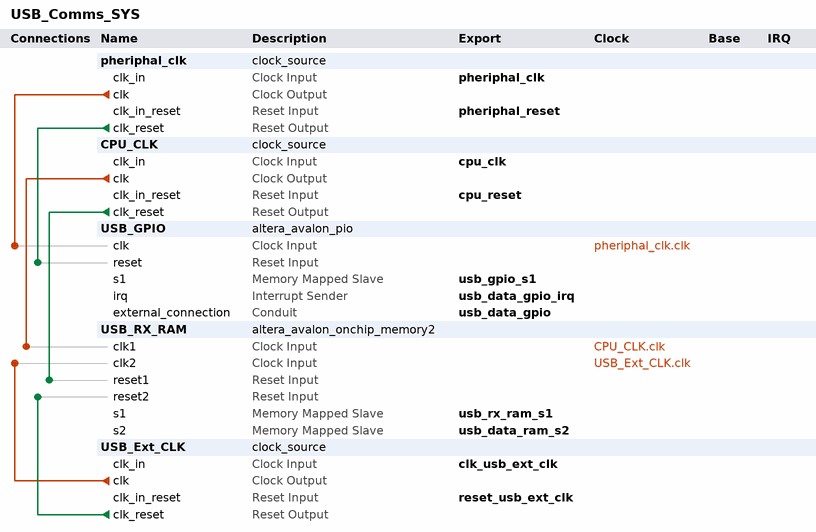
[diagram p0: system contents]
# Platform Designer (Qsys) system USB_Comms_SYS, MAX 10 10M50DAF484I7G
# Parameters at their usual value, and those the tool derives, are not listed.
package require -exact qsys 18.1
create_system USB_Comms_SYS
set_project_property DEVICE_FAMILY {MAX 10}
set_project_property DEVICE 10M50DAF484I7G

add_instance pheriphal_clk clock_source 18.1
set_instance_parameter_value pheriphal_clk clockFrequency 50000000

add_instance CPU_CLK clock_source 18.1
set_instance_parameter_value CPU_CLK clockFrequency 50000000

add_instance USB_GPIO altera_avalon_pio 18.1
set_instance_parameter_value USB_GPIO bitModifyingOutReg true
set_instance_parameter_value USB_GPIO captureEdge true
set_instance_parameter_value USB_GPIO direction InOut
set_instance_parameter_value USB_GPIO edgeType FALLING
set_instance_parameter_value USB_GPIO generateIRQ true
set_instance_parameter_value USB_GPIO irqType EDGE
set_instance_parameter_value USB_GPIO simDoTestBenchWiring true
set_instance_parameter_value USB_GPIO width 1

add_instance USB_RX_RAM altera_avalon_onchip_memory2 18.1
set_instance_parameter_value USB_RX_RAM dataWidth 32
set_instance_parameter_value USB_RX_RAM dualPort true
set_instance_parameter_value USB_RX_RAM initMemContent false
set_instance_parameter_value USB_RX_RAM initializationFileName onchip_mem.hex
set_instance_parameter_value USB_RX_RAM memorySize 4100

add_instance USB_Ext_CLK clock_source 18.1
set_instance_parameter_value USB_Ext_CLK clockFrequency 50000000

# connections
add_connection CPU_CLK.clk USB_RX_RAM.clk1 clock
add_connection pheriphal_clk.clk USB_GPIO.clk clock
add_connection USB_Ext_CLK.clk USB_RX_RAM.clk2 clock
add_connection CPU_CLK.clk_reset USB_RX_RAM.reset1 reset
add_connection pheriphal_clk.clk_reset USB_GPIO.reset reset
add_connection USB_Ext_CLK.clk_reset USB_RX_RAM.reset2 reset

# exported interfaces
add_interface clk_usb_ext_clk clock sink
set_interface_property clk_usb_ext_clk EXPORT_OF USB_Ext_CLK.clk_in
add_interface cpu_clk clock sink
set_interface_property cpu_clk EXPORT_OF CPU_CLK.clk_in
add_interface cpu_reset reset sink
set_interface_property cpu_reset EXPORT_OF CPU_CLK.clk_in_reset
add_interface pheriphal_clk clock sink
set_interface_property pheriphal_clk EXPORT_OF pheriphal_clk.clk_in
add_interface pheriphal_reset reset sink
set_interface_property pheriphal_reset EXPORT_OF pheriphal_clk.clk_in_reset
add_interface reset_usb_ext_clk reset sink
set_interface_property reset_usb_ext_clk EXPORT_OF USB_Ext_CLK.clk_in_reset
add_interface usb_data_gpio conduit end
set_interface_property usb_data_gpio EXPORT_OF USB_GPIO.external_connection
add_interface usb_data_gpio_irq interrupt sender
set_interface_property usb_data_gpio_irq EXPORT_OF USB_GPIO.irq
add_interface usb_data_ram_s2 avalon slave
set_interface_property usb_data_ram_s2 EXPORT_OF USB_RX_RAM.s2
add_interface usb_gpio_s1 avalon slave
set_interface_property usb_gpio_s1 EXPORT_OF USB_GPIO.s1
add_interface usb_rx_ram_s1 avalon slave
set_interface_property usb_rx_ram_s1 EXPORT_OF USB_RX_RAM.s1

set_interconnect_requirement {$system} qsys_mm.clockCrossingAdapter HANDSHAKE
set_interconnect_requirement {$system} qsys_mm.enableEccProtection FALSE
set_interconnect_requirement {$system} qsys_mm.insertDefaultSlave FALSE
set_interconnect_requirement {$system} qsys_mm.maxAdditionalLatency 1

save_system USB_Comms_SYS.qsys
